# Altium schematic sheet Programmer_Sheet.SchDoc
size A
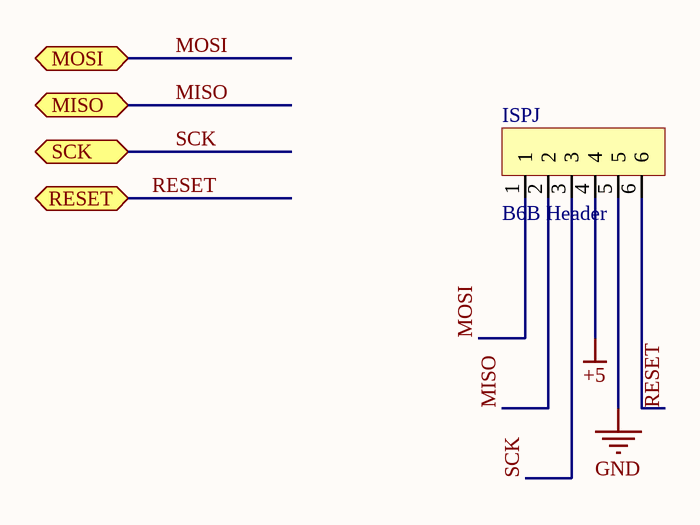
[diagram p0: Programmer_Sheet.SchDoc]

## Parts
ISPJ  B6B Header  [PCBComponent_1]

## Ports
MISO (bidir), MOSI (bidir), RESET (bidir), SCK (bidir)

## Nets
+5: ISPJ.4
GND: ISPJ.5
MISO: ISPJ.2 ; port MISO
MOSI: ISPJ.1 ; port MOSI
RESET: ISPJ.6 ; port RESET
SCK: ISPJ.3 ; port SCK

## Library data of the parts
ISPJ = Component_1